# EAGLE design teste01 (EAGLE 6.1)
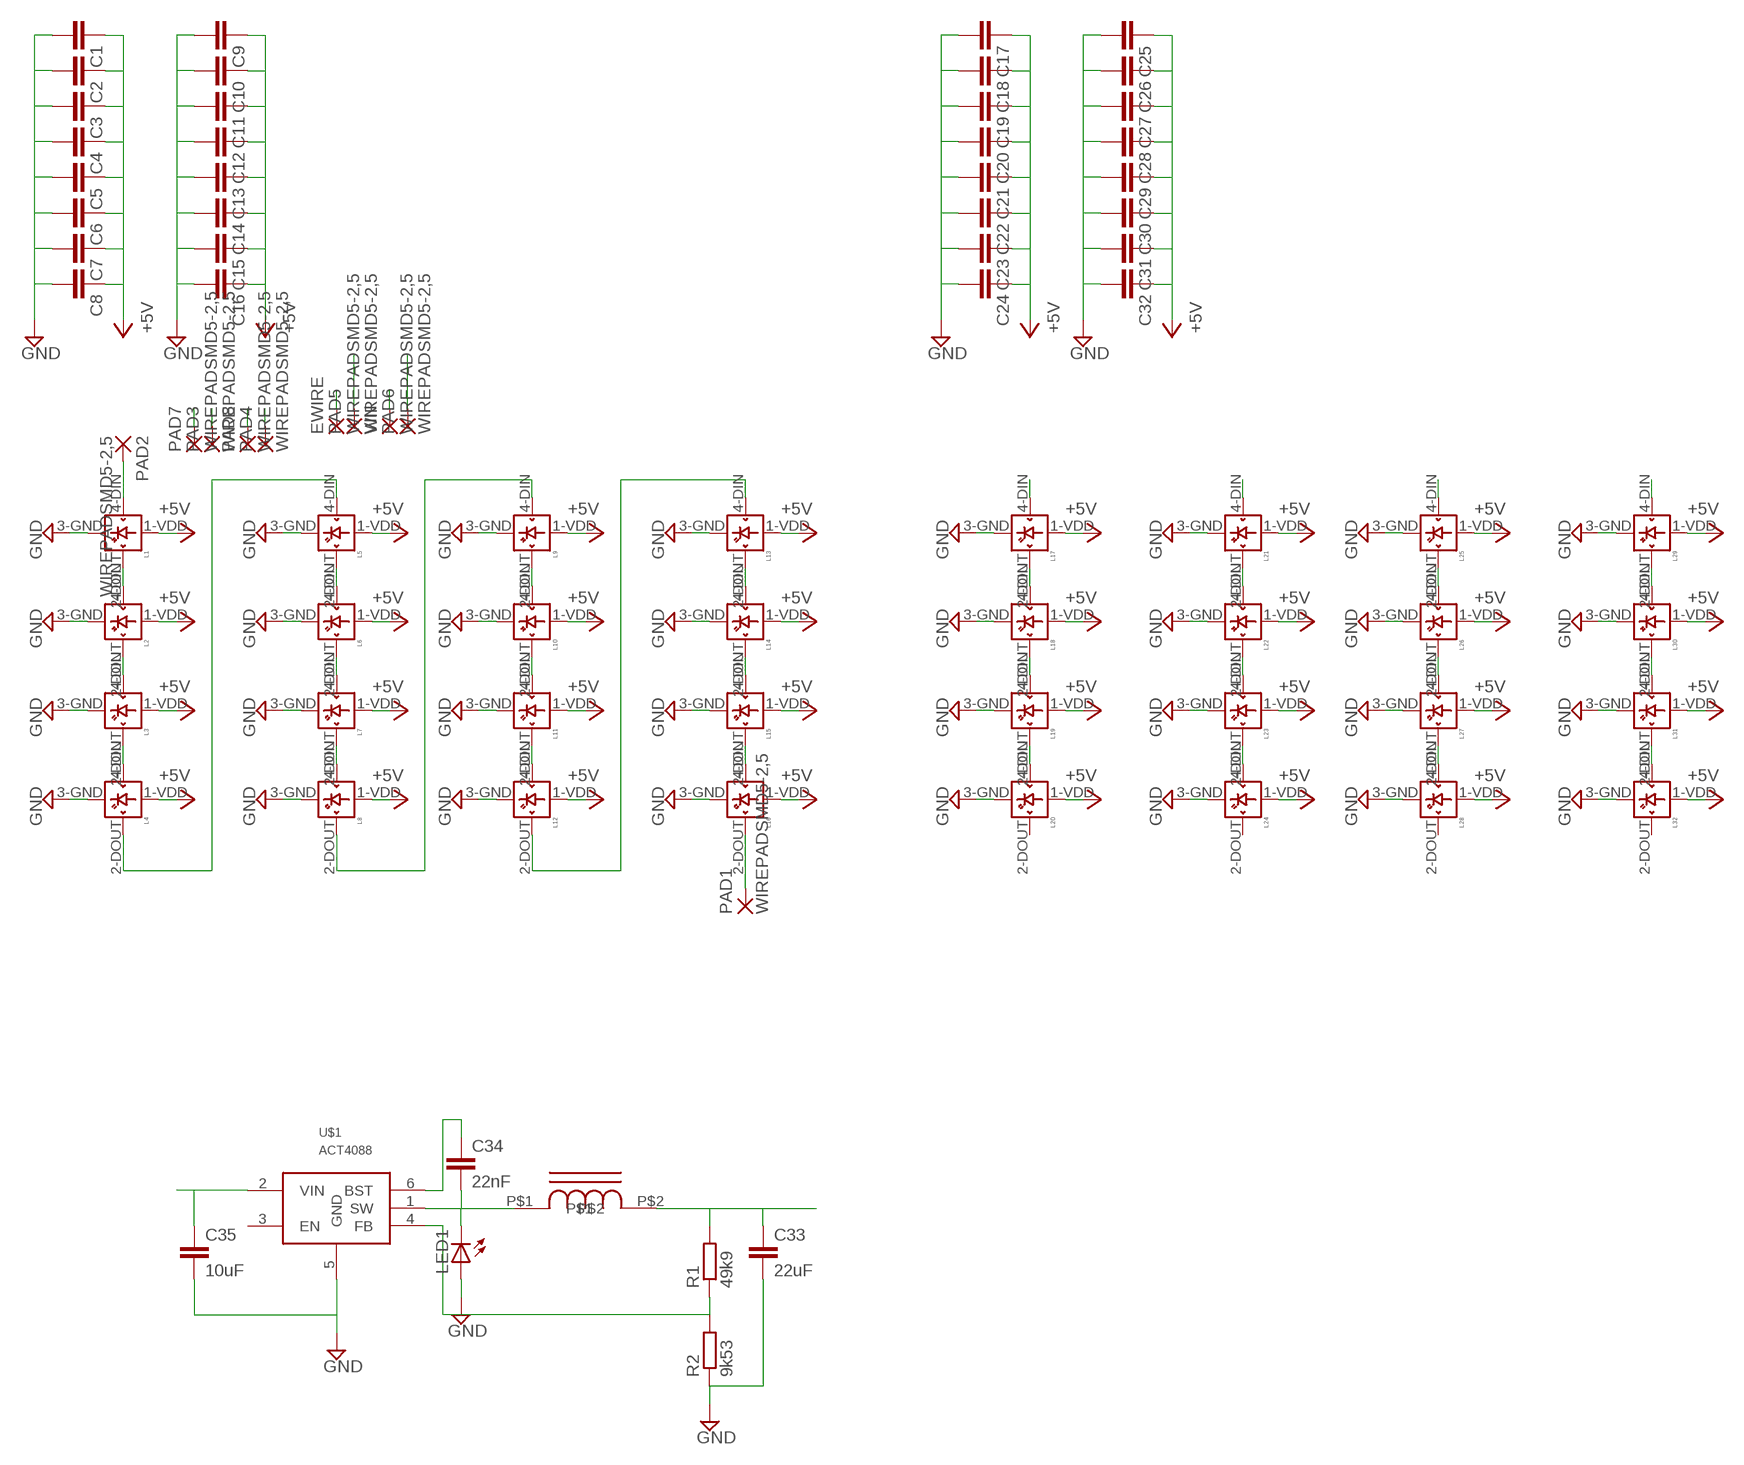
[diagram p0: schematic, sheet 1]

## Parts
C1  C-EUC0805K  [C0805K]
C2  C-EUC0805K  [C0805K]
C3  C-EUC0805K  [C0805K]
C4  C-EUC0805K  [C0805K]
C5  C-EUC0805K  [C0805K]
C6  C-EUC0805K  [C0805K]
C7  C-EUC0805K  [C0805K]
C8  C-EUC0805K  [C0805K]
C9  C-EUC0805K  [C0805K]
C10  C-EUC0805K  [C0805K]
C11  C-EUC0805K  [C0805K]
C12  C-EUC0805K  [C0805K]
C13  C-EUC0805K  [C0805K]
C14  C-EUC0805K  [C0805K]
C15  C-EUC0805K  [C0805K]
C16  C-EUC0805K  [C0805K]
C17  C-EUC0805K  [C0805K]
C18  C-EUC0805K  [C0805K]
C19  C-EUC0805K  [C0805K]
C20  C-EUC0805K  [C0805K]
C21  C-EUC0805K  [C0805K]
C22  C-EUC0805K  [C0805K]
C23  C-EUC0805K  [C0805K]
C24  C-EUC0805K  [C0805K]
C25  C-EUC0805K  [C0805K]
C26  C-EUC0805K  [C0805K]
C27  C-EUC0805K  [C0805K]
C28  C-EUC0805K  [C0805K]
C29  C-EUC0805K  [C0805K]
C30  C-EUC0805K  [C0805K]
C31  C-EUC0805K  [C0805K]
C32  C-EUC0805K  [C0805K]
C33  22uF  C-EUC1210  [C1210]
C34  22nF  C-EUC0805  [C0805]
C35  10uF  C-EUC1210  [C1210]
EWIRE  WIREPADSMD5-2,5  [5-2,5]
L1  WS2812B  [WS2812B]
L2  WS2812B  [WS2812B]
L3  WS2812B  [WS2812B]
L4  WS2812B  [WS2812B]
L5  WS2812B  [WS2812B]
L6  WS2812B  [WS2812B]
L7  WS2812B  [WS2812B]
L8  WS2812B  [WS2812B]
L9  WS2812B  [WS2812B]
L10  WS2812B  [WS2812B]
L11  WS2812B  [WS2812B]
L12  WS2812B  [WS2812B]
L13  WS2812B  [WS2812B]
L14  WS2812B  [WS2812B]
L15  WS2812B  [WS2812B]
L16  WS2812B  [WS2812B]
L17  WS2812B  [WS2812B]
L18  WS2812B  [WS2812B]
L19  WS2812B  [WS2812B]
L20  WS2812B  [WS2812B]
L21  WS2812B  [WS2812B]
L22  WS2812B  [WS2812B]
L23  WS2812B  [WS2812B]
L24  WS2812B  [WS2812B]
L25  WS2812B  [WS2812B]
L26  WS2812B  [WS2812B]
L27  WS2812B  [WS2812B]
L28  WS2812B  [WS2812B]
L29  WS2812B  [WS2812B]
L30  WS2812B  [WS2812B]
L31  WS2812B  [WS2812B]
L32  WS2812B  [WS2812B]
LED1  LED1206  [LED-1206]
PAD1  WIREPADSMD5-2,5  [5-2,5]
PAD2  WIREPADSMD5-2,5  [5-2,5]
PAD3  WIREPADSMD5-2,5  [5-2,5]
PAD4  WIREPADSMD5-2,5  [5-2,5]
PAD5  WIREPADSMD5-2,5  [5-2,5]
PAD6  WIREPADSMD5-2,5  [5-2,5]
PAD7  WIREPADSMD5-2,5  [5-2,5]
PAD8  WIREPADSMD5-2,5  [5-2,5]
R1  49k9  R-EU_M0805  [M0805]
R2  9k53  R-EU_M0805  [M0805]
U$1  ACT4088  [SOT23-6]
U$2  INDUCTOR  [6060]
VIN  WIREPADSMD5-2,5  [5-2,5]

## Nets
+5V: C1.1 C2.1 C3.1 C4.1 C5.1 C6.1 C7.1 C8.1 C9.1 C10.1 C11.1 C12.1 C13.1 C14.1 C15.1 C16.1 C17.1 C18.1 C19.1 C20.1 C21.1 C22.1 C23.1 C24.1 C25.1 C26.1 C27.1 C28.1 C29.1 C30.1 C31.1 C32.1 L1.1-VDD(VDD) L2.1-VDD(VDD) L3.1-VDD(VDD) L4.1-VDD(VDD) L5.1-VDD(VDD) L6.1-VDD(VDD) L7.1-VDD(VDD) L8.1-VDD(VDD) L9.1-VDD(VDD) L10.1-VDD(VDD) L11.1-VDD(VDD) L12.1-VDD(VDD) L13.1-VDD(VDD) L14.1-VDD(VDD) L15.1-VDD(VDD) L16.1-VDD(VDD) L17.1-VDD(VDD) L18.1-VDD(VDD) L19.1-VDD(VDD) L20.1-VDD(VDD) L21.1-VDD(VDD) L22.1-VDD(VDD) L23.1-VDD(VDD) L24.1-VDD(VDD) L25.1-VDD(VDD) L26.1-VDD(VDD) L27.1-VDD(VDD) L28.1-VDD(VDD) L29.1-VDD(VDD) L30.1-VDD(VDD) L31.1-VDD(VDD) L32.1-VDD(VDD)
GND: C1.2 C2.2 C3.2 C4.2 C5.2 C6.2 C7.2 C8.2 C9.2 C10.2 C11.2 C12.2 C13.2 C14.2 C15.2 C16.2 C17.2 C18.2 C19.2 C20.2 C21.2 C22.2 C23.2 C24.2 C25.2 C26.2 C27.2 C28.2 C29.2 C30.2 C31.2 C32.2 C33.2 C35.2 L1.3-GND(GND) L2.3-GND(GND) L3.3-GND(GND) L4.3-GND(GND) L5.3-GND(GND) L6.3-GND(GND) L7.3-GND(GND) L8.3-GND(GND) L9.3-GND(GND) L10.3-GND(GND) L11.3-GND(GND) L12.3-GND(GND) L13.3-GND(GND) L14.3-GND(GND) L15.3-GND(GND) L16.3-GND(GND) L17.3-GND(GND) L18.3-GND(GND) L19.3-GND(GND) L20.3-GND(GND) L21.3-GND(GND) L22.3-GND(GND) L23.3-GND(GND) L24.3-GND(GND) L25.3-GND(GND) L26.3-GND(GND) L27.3-GND(GND) L28.3-GND(GND) L29.3-GND(GND) L30.3-GND(GND) L31.3-GND(GND) L32.3-GND(GND) LED1.A PAD3.1(P) PAD4.1(P) PAD7.1(P) PAD8.1(P) R2.1 U$1.5(GND)
N$1: L1.2-DOUT(DOUT) L2.4-DIN(DIN)
N$2: L2.2-DOUT(DOUT) L3.4-DIN(DIN)
N$3: L1.4-DIN(DIN) PAD2.1(P)
N$4: L3.2-DOUT(DOUT) L4.4-DIN(DIN)
N$5: L4.2-DOUT(DOUT) L5.4-DIN(DIN)
N$6: L5.2-DOUT(DOUT) L6.4-DIN(DIN)
N$7: L6.2-DOUT(DOUT) L7.4-DIN(DIN)
N$8: L7.2-DOUT(DOUT) L8.4-DIN(DIN)
N$9: L8.2-DOUT(DOUT) L9.4-DIN(DIN)
N$10: L9.2-DOUT(DOUT) L10.4-DIN(DIN)
N$11: L10.2-DOUT(DOUT) L11.4-DIN(DIN)
N$12: L11.2-DOUT(DOUT) L12.4-DIN(DIN)
N$13: L12.2-DOUT(DOUT) L13.4-DIN(DIN)
N$14: L13.2-DOUT(DOUT) L14.4-DIN(DIN)
N$15: L14.2-DOUT(DOUT) L15.4-DIN(DIN)
N$16: L15.2-DOUT(DOUT) L16.4-DIN(DIN)
N$17: L17.4-DIN(DIN)
N$18: L17.2-DOUT(DOUT) L18.4-DIN(DIN)
N$19: L18.2-DOUT(DOUT) L19.4-DIN(DIN)
N$20: L19.2-DOUT(DOUT) L20.4-DIN(DIN)
N$21: L21.4-DIN(DIN)
N$22: L21.2-DOUT(DOUT) L22.4-DIN(DIN)
N$23: L22.2-DOUT(DOUT) L23.4-DIN(DIN)
N$24: L23.2-DOUT(DOUT) L24.4-DIN(DIN)
N$25: L25.4-DIN(DIN)
N$26: L25.2-DOUT(DOUT) L26.4-DIN(DIN)
N$27: L26.2-DOUT(DOUT) L27.4-DIN(DIN)
N$28: L27.2-DOUT(DOUT) L28.4-DIN(DIN)
N$29: L29.4-DIN(DIN)
N$30: L29.2-DOUT(DOUT) L30.4-DIN(DIN)
N$31: L30.2-DOUT(DOUT) L31.4-DIN(DIN)
N$32: L31.2-DOUT(DOUT) L32.4-DIN(DIN)
N$33: L16.2-DOUT(DOUT) PAD1.1(P)
N$34: C34.2 LED1.C U$1.1(SW) U$2.P$1
N$35: C33.1 R1.2 U$2.P$2
N$36: R1.1 R2.2 U$1.4(FB)
N$40: C34.1 U$1.6(BST)
VIN: C35.1 EWIRE.1(P) PAD5.1(P) PAD6.1(P) U$1.2(VIN) VIN.1(P)
Unconnected: L20.2-DOUT(DOUT) L24.2-DOUT(DOUT) L28.2-DOUT(DOUT) L32.2-DOUT(DOUT) U$1.3(EN)

## Library data of the parts
C1-C32 C34 = resistor:C-EU: CAPACITOR, European symbol
C33 C35 = rcl:C-EU: CAPACITOR, European symbol
EWIRE PAD1-PAD8 VIN = wirepad:WIREPAD: Wire PAD connect wire on PCB
L1-L32 = adafruit:WS2812B
LED1 = LilyPad-Wearables:LED: LEDs Standard schematic elements and footprints for 5mm, 3mm, 1206, and 0603 sized LEDs. 5mm - Spark Fun Electronics SKU : Comp-SBL
R1 R2 = rcl:R-EU_: RESISTOR, European symbol
U$1 = wes:ACT4088
U$2 = wes:INDUCTOR

## Board
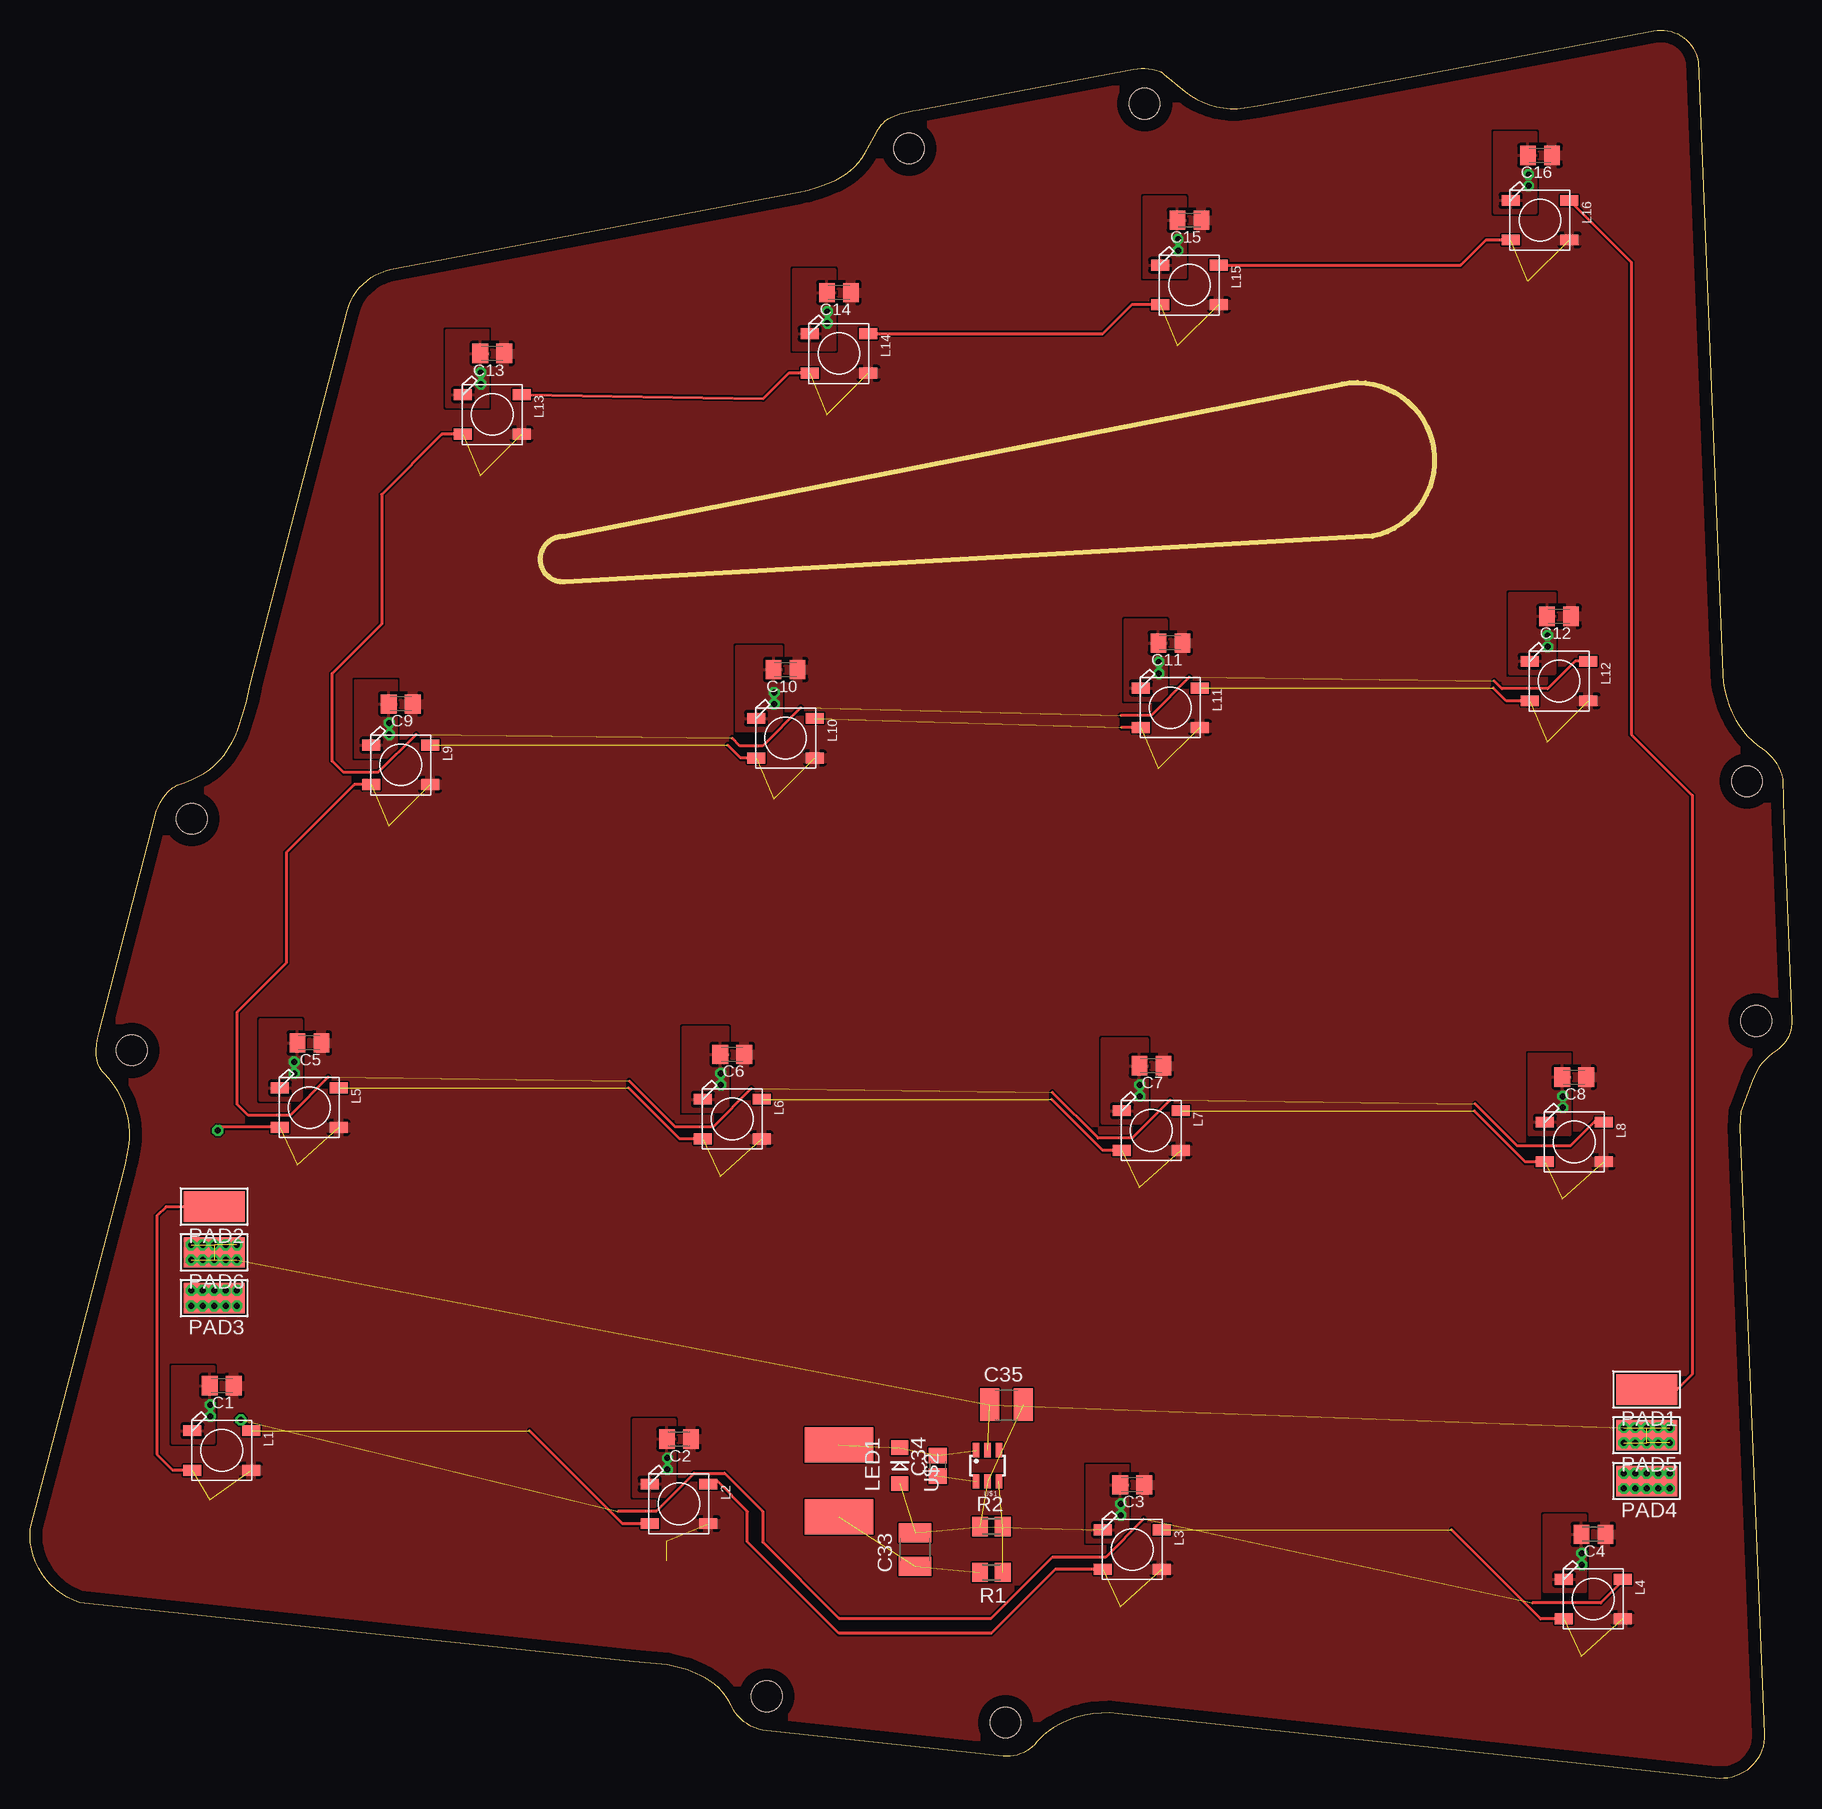
[diagram p1: board, top side]
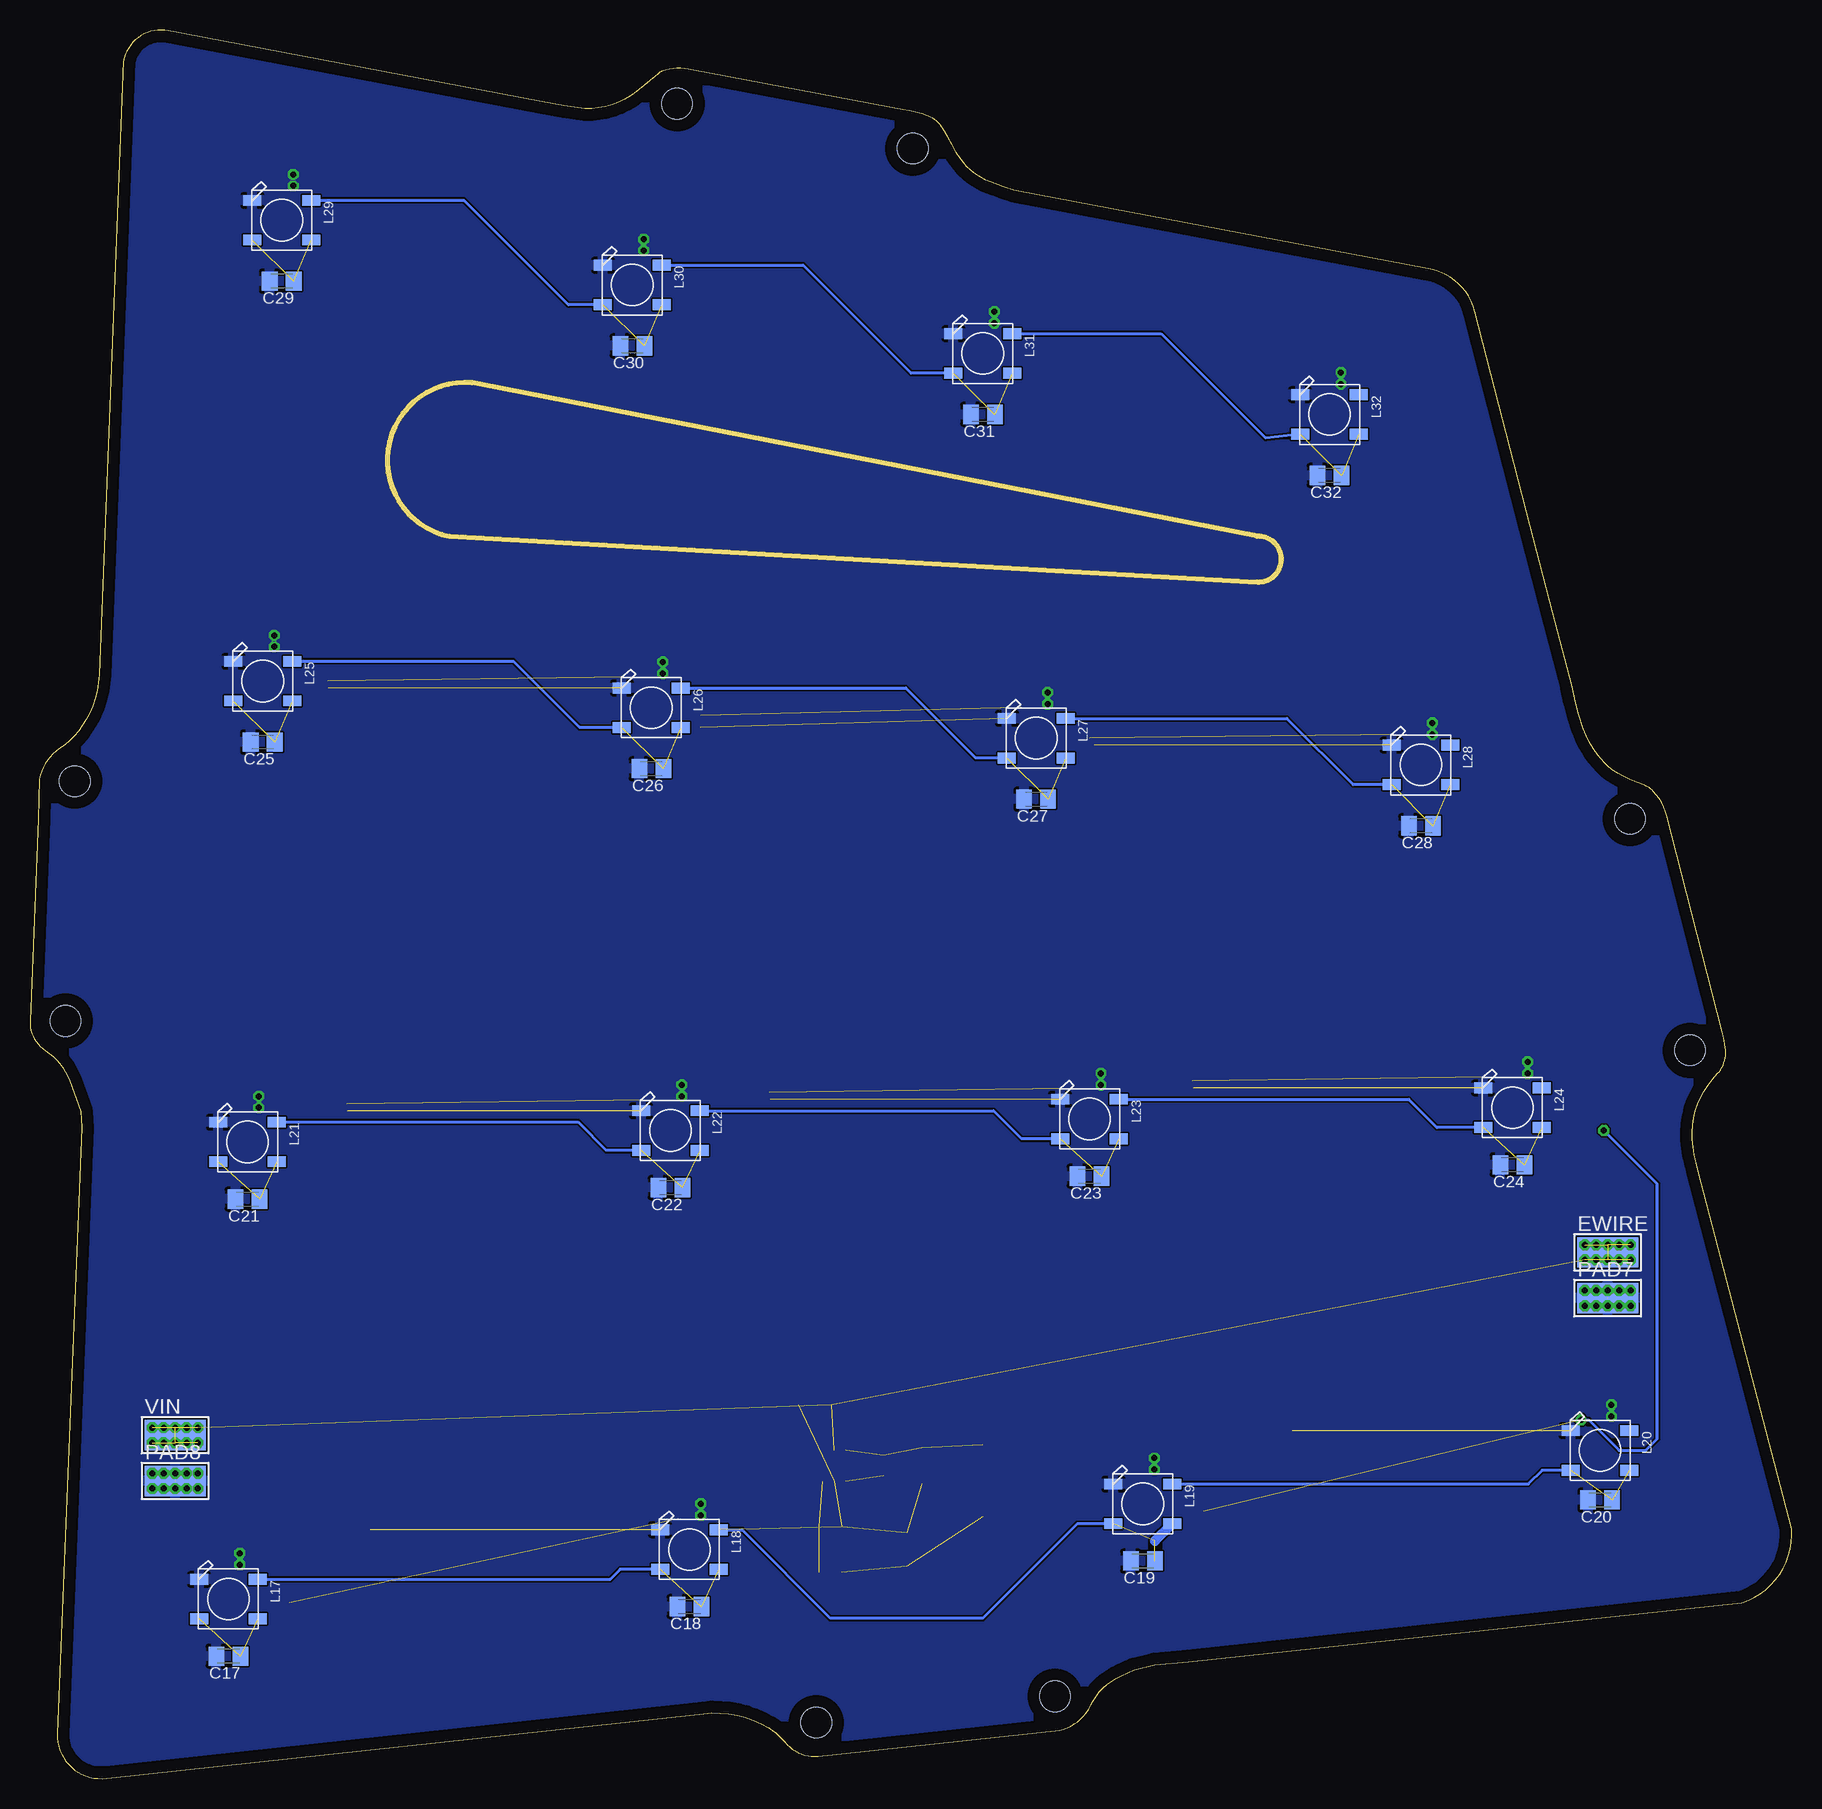
[diagram p2: board, bottom side, seen from below]

Size 146.81 x 145.75 mm. Coordinates in mm from the lower left corner, seen from the top.
Outline: 0.02,20.83 7.8,50.63 arc6 8.23,52.66 arc40 7.3,57.31 arc12 6.2,58.75 arc-48 5.52,60.7 arc-9 5.77,62.22 10.43,80.26 arc-28 11.53,82.29 arc-28 12.29,82.8 arc7 14.07,83.56 arc27 16.19,85.34 arc16 17.37,87.54 arc10 18.3,91.01 19.91,97.19 21.77,104.38 26.43,122.33 arc-64 30.07,125.8 64.02,132.24 arc14 67.15,133.25 arc35 69.6,135.54 arc0 70.71,137.49 arc-39 71.98,138.59 arc-16 74.09,139.09 91.95,142.48 arc-30 94.16,142.31 arc-35 94.49,142.06 96.27,140.62 arc47 101.18,139.26 arc4 104.57,139.86 135.3,145.7 arc-90 139.02,143.16 141.06,92.02 arc28 142.16,88.21 arc26 144.36,85.84 arc-44 146.05,83.3 146.14,80 146.81,63.16 arc-59 145.54,60.7 arc37 143.51,58.16 142.58,55.62 142.5,54.27 144.53,3.73 arc-95 140.8,0 90.68,5.42 arc37 85.27,4.23 arc21 83.91,3.05 arc-57 81.12,1.86 61.39,3.98 arc-59 58.43,6.1 arc42 55.89,8.55 54.79,9.06 53.1,9.48 50.3,9.74 4.16,14.65 arc-76 0.02,20.83
Copper layers (1*16): Top 0.035mm / dielectric 1.5mm / Bottom 0.035mm
Design rules: minimum track width 10mil, minimum drill 24mil, track to track 6mil, track to pad 6mil, pad to pad 6mil, via to via 6mil, smd to smd 6mil, copper to edge 40mil, drill to drill 8mil, minimum pad ring 10mil, minimum via ring 8mil, stop-mask expansion 4mil, vias tented up to drill 0mil, thermal gap 10mil
Holes 2.54 mm at 61.39,6.86 81.29,4.66 8.48,60.7 13.48,80 73.25,135.88 92.89,139.6 143.09,83.13 143.85,63.16
Milling: 4 lines

### Footprints (pad centres in the part's own frame; a part is rotated, then mirrored left to right if it is on the bottom)
C0805K = smd 1.3 x 1.6: 1 -1,0; 2 1,0
C1210 = smd 1.6 x 2.7: 1 -1.4,0; 2 1.4,0
C0805 = smd 1.3 x 1.5: 1 -0.85,0; 2 0.85,0
5-2,5 = smd 2.54 x 5.08: 1 0,0
WS2812B = smd 1.5 x 0.9: 1-VDD 2.45,-1.65; 2-DOUT 2.45,1.65; 3-GND -2.45,1.65; 4-DIN -2.45,-1.65
LED-1206 = smd 1.2 x 1.4: A -1.5,0; C 1.5,0
M0805 = smd 1.3 x 1.6: 1 -0.95,0; 2 0.95,0
SOT23-6 = smd 0.55 x 1.2: 1 0.95,-1.3; 2 0,-1.3; 3 -0.95,-1.3; 4 -0.95,1.3; 5 0,1.3; 6 0.95,1.3
6060 = smd 2.9 x 5.7: P$1 -3,0; P$2 3,0

### Placement (x,y rotation side)
C1  15.98,32.74 180 top
C2  54.08,28.3 180 top
C3  91.86,24.49 180 top
C4  130.28,20.36 180 top
C5  23.28,61.32 180 top
C6  58.52,60.37 180 top
C7  93.45,59.41 180 top
C8  128.69,58.46 180 top
C9  30.9,89.58 180 top
C10  62.97,92.43 180 top
C11  95.03,94.66 180 top
C12  127.42,96.88 180 top
C13  38.52,118.79 180 top
C14  67.41,123.87 180 top
C15  96.62,129.9 180 top
C16  125.83,135.3 180 top
C17  130.28,10.2 180 bottom
C18  91.86,14.33 180 bottom
C19  54.08,18.14 180 bottom
C20  15.98,23.22 180 bottom
C21  128.69,48.3 180 bottom
C22  93.45,49.25 180 bottom
C23  58.52,50.21 180 bottom
C24  23.28,51.16 180 bottom
C25  127.42,86.4 180 bottom
C26  95.03,84.18 180 bottom
C27  62.97,81.64 180 bottom
C28  30.9,79.42 180 bottom
C29  125.83,124.82 180 bottom
C30  96.62,119.42 180 bottom
C31  67.41,113.71 180 bottom
C32  38.52,108.63 180 bottom
C33  73.76,19.09 90 top
C34  75.67,26.08 90 top
C35  81.38,31.16 0 top
EWIRE  15.34,43.86 270 bottom
L1  15.98,27.35 0 top
L2  54.08,22.9 0 top
L3  91.86,19.09 0 top
L4  130.28,14.96 0 top
L5  23.28,55.92 0 top
L6  58.52,54.97 0 top
L7  93.45,54.02 0 top
L8  128.69,53.06 0 top
L9  30.9,84.5 0 top
L10  62.97,86.72 0 top
L11  95.03,89.26 0 top
L12  127.42,91.48 0 top
L13  38.52,113.71 0 top
L14  67.41,118.79 0 top
L15  96.62,124.5 0 top
L16  125.83,129.9 0 top
L17  130.28,14.96 0 bottom
L18  91.86,19.09 0 bottom
L19  54.08,22.9 0 bottom
L20  15.98,27.35 0 bottom
L21  128.69,53.06 0 bottom
L22  93.45,54.02 0 bottom
L23  58.52,54.97 0 bottom
L24  23.28,55.92 0 bottom
L25  127.42,91.48 0 bottom
L26  95.03,89.26 0 bottom
L27  62.97,86.72 0 bottom
L28  30.9,84.5 0 bottom
L29  125.83,129.9 0 bottom
L30  96.62,124.5 0 bottom
L31  67.41,118.79 0 bottom
L32  38.52,113.71 0 bottom
LED1  72.49,26.08 90 top
PAD1  134.72,32.43 90 top
PAD2  15.34,47.67 90 top
PAD3  15.34,40.05 90 top
PAD4  134.72,24.81 90 top
PAD5  134.72,28.62 90 top
PAD6  15.34,43.86 90 top
PAD7  15.34,40.05 270 bottom
PAD8  134.72,24.81 270 bottom
R1  80.11,17.19 180 top
R2  80.11,21 0 top
U$1  79.79,26.08 180 top
U$2  67.41,24.81 270 top
VIN  134.72,28.62 270 bottom

### Tracks (layer width: path | path; a pad name or v marks a point on that pad's centre or on a via)
+5V  (32 unrouted)
  Bottom 0.813: 53.08,19.8 L19.1-VDD
  pour Top (rank 2): -39.27,164.51 -39.27,-24.72 172.82,-24.72 172.82,164.51
GND  (via drill 0.5)  (7 unrouted)
  other vias: 37.57,116.25 37.57,117.2 66.46,121.33 66.46,122.28 95.67,128.31 95.67,127.36 124.88,133.71 124.88,132.76 15.02,31.16 15.02,30.2 53.12,26.71 53.12,25.76 90.91,22.9 90.91,21.95 129.32,18.77 129.32,17.82 127.74,56.87 127.74,55.92 92.49,57.83 92.49,56.87 57.57,58.78 57.57,57.83 22.01,59.73 22.01,58.78 126.47,95.29 126.47,94.34 94.08,93.07 94.08,92.12 62.01,90.53 62.01,89.58 29.95,87.99 29.95,87.04 17.25,40.68 16.29,40.68 15.34,40.68 14.39,40.68 13.44,40.68 13.44,39.41 14.39,39.41 15.34,39.41 16.29,39.41 17.25,39.41 136.63,24.17 135.67,24.17 134.72,24.17 133.77,24.17 132.82,24.17 136.63,25.44 135.67,25.44 134.72,25.44 133.77,25.44 132.82,25.44
  pour Bottom: -31.65,169.59 -31.65,-14.56 184.25,-14.56 184.25,169.59 -30.38,169.59
  pour Top: 34.71,120.69 34.71,114.34 38.2,114.34 38.2,120.69
  pour Top: 63.6,125.77 63.6,119.1 67.09,119.1 67.09,125.77
  pour Top: 92.81,131.8 92.81,125.14 96.3,125.14 96.3,131.8
  pour Top: 122.02,137.2 122.02,130.53 125.51,130.53 125.51,137.2
  pour Top: 123.29,98.78 123.29,92.12 127.1,92.12 127.1,98.78
  pour Top: 91.22,96.56 91.22,89.89 94.72,89.89 94.72,96.56
  pour Top: 58.84,94.34 58.84,87.35 62.65,87.35 62.65,94.34
  pour Top: 27.09,91.48 27.09,85.13 30.58,85.13 30.58,91.48
  pour Top: 19.15,63.22 19.15,56.56 22.64,56.56 22.64,63.22
  pour Top: 54.39,62.59 54.39,55.6 58.2,55.6 58.2,62.59
  pour Top: 89.32,61.64 89.32,54.65 93.13,54.65 93.13,61.64
  pour Top: 124.88,60.37 124.88,53.7 128.37,53.7 128.37,60.37
  pour Top: 126.15,21.95 126.15,15.6 129.64,15.6 129.64,21.95
  pour Top: 88.05,26.08 88.05,19.73 90.78,19.73 91.54,20.49 91.54,26.08
  pour Top: 11.85,34.33 11.85,27.98 15.34,27.98 15.34,34.33
  pour Top: 50.27,29.89 50.27,23.54 53,23.54 53.76,24.3 53.76,29.89
N$1  (1 unrouted)
  Top 0.254: 41.63,29 49.38,21.25 L2.4-DIN
N$2
  Top 0.254: L3.4-DIN 85.45,17.44 80.11,12.11 67.41,12.11 59.79,19.73 59.79,22.27 57.25,24.81 56.78,24.81 L2.2-DOUT
N$3
  Top 0.254: L1.4-DIN 11.91,25.7 10.58,27.03 10.58,46.91 11.34,47.67 PAD2.1
N$4  (1 unrouted)
  Top 0.254: 118.47,20.74 125.89,13.32 L4.4-DIN
N$5  (via drill 0.5)  (2 unrouted)
  Top 0.254: L4.2-DOUT 132.73,16.46 130.91,14.65 125.2,14.65 | 92.81,21.63 89.64,18.46 85.19,18.46 80.11,13.38 67.41,13.38 61.06,19.73 61.06,22.27 57.89,25.44 55.35,25.44 52.17,22.27 49,22.27 | v15.66,54.02 15.98,54.34 20.77,54.34 L5.4-DIN
  Bottom 0.254: v17.56,29.89 16.93,29.89 14.39,27.35 12.17,27.35 11.21,28.3 11.21,49.57 v15.66,54.02
N$6  (1 unrouted)
  Top 0.254: 49.89,57.57 54.14,53.32 L6.4-DIN
N$7  (1 unrouted)
  Top 0.254: 85.13,56.62 89.38,52.37 L7.4-DIN
N$8  (1 unrouted)
  Top 0.254: 120.37,55.67 124.62,51.42 L8.4-DIN
N$9  (3 unrouted)
  Top 0.254: L8.2-DOUT 130.34,54.71 128.37,52.75 123.93,52.75 120.43,56.24 | 95.03,56.56 91.86,53.38 89,53.38 85.19,57.19 | 60.11,57.51 56.93,54.34 53.76,54.34 49.95,58.14 | 24.87,58.46 21.69,55.29 18.2,55.29 17.25,56.24 17.25,63.86 21.37,67.99 21.37,77.19 27.03,82.85 L9.4-DIN
N$10  (1 unrouted)
  Top 0.254: L10.4-DIN 59.22,85.07 58.14,86.15
N$11  (1 unrouted)
  Top 0.254: L11.4-DIN 90.97,87.61
N$12  (1 unrouted)
  Top 0.254: L12.4-DIN 123.04,89.83 121.96,90.91
N$13  (3 unrouted)
  Top 0.254: L12.2-DOUT 128.75,93.13 126.47,90.85 122.66,90.85 122.02,91.48 | 96.62,91.8 93.45,88.63 90.91,88.63 | 64.24,89.26 61.06,86.08 59.16,86.08 58.52,86.72 | 32.17,87.04 28.99,83.86 26.14,83.86 25.18,84.81 25.18,92.12 29.31,96.25 29.31,107.04 34.33,112.06 L13.4-DIN
N$14
  Top 0.254: L13.2-DOUT 61.12,115.04 63.22,117.14 L14.4-DIN
N$15
  Top 0.254: L14.2-DOUT 89.38,120.44 91.8,122.85 L15.4-DIN
N$16
  Top 0.254: L15.2-DOUT 119.23,126.15 121.32,128.25 L16.4-DIN
N$18
  Bottom 0.254: L17.2-DOUT 98.46,16.61 97.64,17.44 L18.4-DIN
N$19
  Bottom 0.254: L19.4-DIN 59.54,21.25 67.41,13.38 80.11,13.38 87.48,20.74 L18.2-DOUT
N$20
  Bottom 0.254: L19.2-DOUT 21.95,24.55 20.8,25.7 L20.4-DIN
N$22
  Bottom 0.254: L21.2-DOUT 101.13,54.71 98.78,52.37 L22.4-DIN
N$23
  Bottom 0.254: L22.2-DOUT 66.52,55.67 64.17,53.32 L23.4-DIN
N$24
  Bottom 0.254: L23.2-DOUT 31.91,56.62 29.57,54.27 L24.4-DIN
N$26
  Bottom 0.254: L25.2-DOUT 106.53,93.13 101,87.61 L26.4-DIN
N$27
  Bottom 0.254: L26.2-DOUT 73.82,90.91 67.98,85.07 L27.4-DIN
N$28
  Bottom 0.254: L27.2-DOUT 42.07,88.37 36.55,82.85 L28.4-DIN
N$30
  Bottom 0.254: L29.2-DOUT 110.65,131.55 101.96,122.85 L30.4-DIN
N$31
  Bottom 0.254: L30.2-DOUT 82.4,126.15 73.38,117.14 L31.4-DIN
N$32
  Bottom 0.254: L31.2-DOUT 52.55,120.44 43.85,111.74 L32.4-DIN
N$33
  Top 0.254: L16.2-DOUT 133.45,126.38 133.45,87.04 138.53,81.96 138.53,33.7 137.26,32.43 PAD1.1
N$34  (3 unrouted)
N$35  (2 unrouted)
N$36  (2 unrouted)
N$40  (1 unrouted)
VIN  (via drill 0.5)  (25 unrouted)
  other vias: 17.25,44.49 16.29,44.49 15.34,44.49 14.39,44.49 13.44,44.49 13.44,43.22 14.39,43.22 15.34,43.22 16.29,43.22 17.25,43.22 136.63,29.25 135.67,29.25 134.72,29.25 133.77,29.25 132.82,29.25 132.82,27.98 133.77,27.98 134.72,27.98 135.67,27.98 136.63,27.98